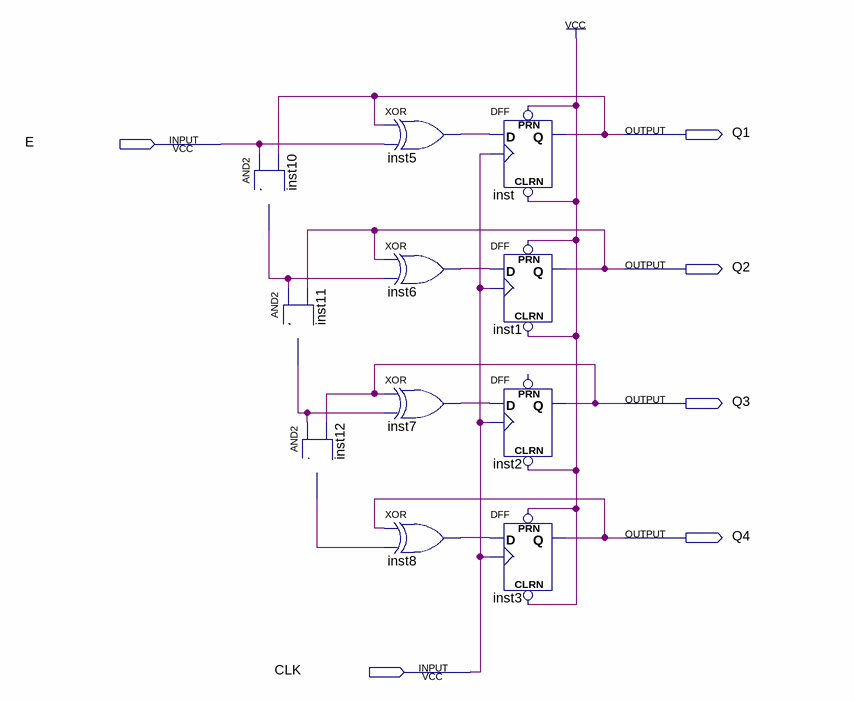
[diagram p0: schematic sheet]
// Quartus schematic lab10step2a.bdf as structural Verilog: 11 symbols, 6 pins
module lab10step2a (
  input  E,
  input  CLK,
  output Q1,
  output Q2,
  output Q3,
  output Q4
);

  wire inst5_out, inst6_out, inst7_out, inst8_out, inst10_out, inst11_out, inst12_out;

  and inst10 (inst10_out, E, Q1);
  and inst11 (inst11_out, inst10_out, Q2);
  and inst12 (inst12_out, inst11_out, Q3);
  xor inst5 (inst5_out, Q1, E);
  xor inst6 (inst6_out, Q2, inst10_out);
  xor inst7 (inst7_out, Q3, inst11_out);
  xor inst8 (inst8_out, Q4, inst12_out);
  DFF inst (.CLRN(1'b1), .CLK(CLK), .D(inst5_out), .PRN(1'b1), .Q(Q1));
  DFF inst1 (.CLRN(1'b1), .CLK(CLK), .D(inst6_out), .PRN(1'b1), .Q(Q2));
  DFF inst2 (.CLRN(1'b1), .CLK(CLK), .D(inst7_out), .Q(Q3));  // open: PRN
  DFF inst3 (.CLRN(1'b1), .CLK(CLK), .D(inst8_out), .PRN(1'b1), .Q(Q4));
endmodule
